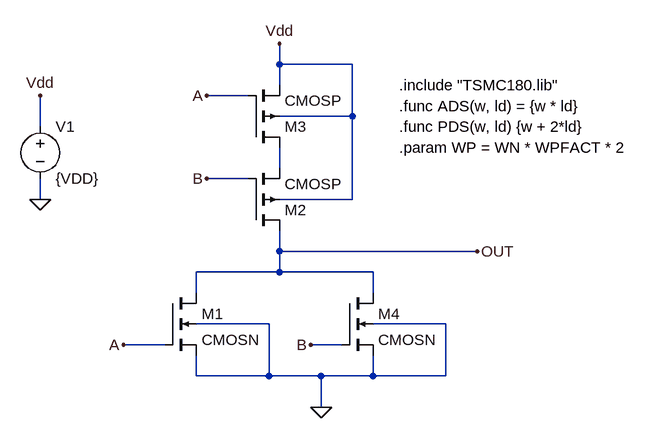
[diagram p0: schematic nor.asc]
nor.asc, the LTspice schematic file:
Version 4
SHEET 1 1180 680
WIRE -112 -96 -112 -128
WIRE 0 -96 -112 -96
WIRE -112 -64 -112 -96
WIRE -160 -48 -224 -48
WIRE 0 -16 0 -96
WIRE 0 -16 -112 -16
WIRE -480 0 -480 -48
WIRE -112 64 -112 32
WIRE -160 80 -224 80
WIRE -480 112 -480 80
WIRE 0 112 0 -16
WIRE 0 112 -112 112
WIRE -112 192 -112 160
WIRE 192 192 -112 192
WIRE -112 224 -112 192
WIRE -112 224 -240 224
WIRE 32 224 -112 224
WIRE -240 256 -240 224
WIRE 32 256 32 224
WIRE -128 304 -240 304
WIRE 144 304 32 304
WIRE -288 336 -352 336
WIRE -16 336 -64 336
WIRE -240 384 -240 352
WIRE -128 384 -128 304
WIRE -128 384 -240 384
WIRE -48 384 -128 384
WIRE 32 384 32 352
WIRE 32 384 -48 384
WIRE 144 384 144 304
WIRE 144 384 32 384
WIRE -48 432 -48 384
FLAG -480 -48 Vdd
FLAG -480 112 0
FLAG -48 432 0
FLAG -112 -128 Vdd
FLAG -224 -48 A
FLAG -352 336 A
FLAG -224 80 B
FLAG -64 336 B
FLAG 192 192 OUT
SYMBOL nmos4 -288 256 R0
SYMATTR InstName M1
SYMATTR Value CMOSN
SYMATTR Value2 l={L} w={WN} ad={ADS(WN,LD)} as={ADS(WN,LD)} pd={PDS(WN,LD)} ps={PDS(WN,LD)}
SYMBOL pmos4 -160 160 M180
SYMATTR InstName M2
SYMATTR Value CMOSP
SYMATTR Value2 l={L} w={WP} ad={ADS(WP,LD)} as={ADS(WP,LD)} pd={PDS(WP,LD)} ps={PDS(WP,LD)}
SYMBOL voltage -480 -16 R0
WINDOW 123 0 0 Left 0
WINDOW 39 0 0 Left 0
SYMATTR InstName V1
SYMATTR Value {VDD}
SYMBOL pmos4 -160 32 M180
SYMATTR InstName M3
SYMATTR Value CMOSP
SYMATTR Value2 l={L} w={WP} ad={ADS(WP,LD)} as={ADS(WP,LD)} pd={PDS(WP,LD)} ps={PDS(WP,LD)}
SYMBOL nmos4 -16 256 R0
SYMATTR InstName M4
SYMATTR Value CMOSN
SYMATTR Value2 l={L} w={WN} ad={ADS(WN,LD)} as={ADS(WN,LD)} pd={PDS(WN,LD)} ps={PDS(WN,LD)}
TEXT 72 32 Left 2 !.param WP = WN * WPFACT * 2
TEXT 72 -64 Left 2 !.include "TSMC180.lib"
TEXT 72 -32 Left 2 !.func ADS(w, ld) = {w * ld}
TEXT 72 0 Left 2 !.func PDS(w, ld) {w + 2*ld}

The netlist it stands for:
* nor.asc
M1 OUT A 0 0 CMOSN l={L} w={WN} ad={ADS(WN,LD)} as={ADS(WN,LD)} pd={PDS(WN,LD)} ps={PDS(WN,LD)}
M2 OUT B N001 Vdd CMOSP l={L} w={WP} ad={ADS(WP,LD)} as={ADS(WP,LD)} pd={PDS(WP,LD)} ps={PDS(WP,LD)}
V1 Vdd 0 {VDD}
M3 N001 A Vdd Vdd CMOSP l={L} w={WP} ad={ADS(WP,LD)} as={ADS(WP,LD)} pd={PDS(WP,LD)} ps={PDS(WP,LD)}
M4 OUT B 0 0 CMOSN l={L} w={WN} ad={ADS(WN,LD)} as={ADS(WN,LD)} pd={PDS(WN,LD)} ps={PDS(WN,LD)}
.model NMOS NMOS
.model PMOS PMOS
.lib standard.mos
.param WP = WN * WPFACT * 2
.include "TSMC180.lib"
.func ADS(w, ld) = {w * ld}
.func PDS(w, ld) {w + 2*ld}
.backanno
.end